# Altium schematic sheet 5V0_Buck.SchDoc: Edit Title in Document Parameters
size B; Address1: # and Street; Address2: City, State, Zip; Address3: Phone#; Address4: USA; DocumentNumber: 2; SheetNumber: 2; SheetTotal: 4; CompanyName: CompanyName; TemplateRev: D-PCD-0111-01
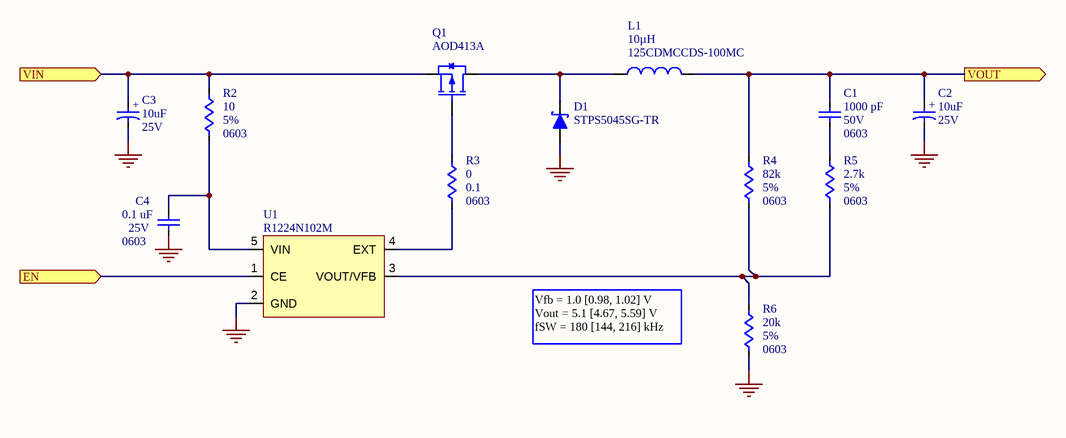
[diagram p0: 5V0_Buck.SchDoc]

## Parts
C1  value 1000 pF  Voltage-Rated: 50V  Package / Case: 0603  [CAPC1608X09N]  (hidden comment: CAP)
C2  value 10uF  Voltage-Rated: 25V  [CAP_TH_5X12_L5]  (hidden comment: CAP-POL)
C3  value 10uF  Voltage-Rated: 25V  [CAP_TH_5X12_L5]  (hidden comment: CAP-POL)
C4  value 0.1 uF  Voltage-Rated: 25V  Package / Case: 0603  [CAPC1608X09N]  (hidden comment: CAP)
D1  Manufacturer Part Number 1: STPS5045SG-TR  [DPAK254P1540X460-3N_STPS5045SG-TR]  (hidden comment: DIO-Schottky_STPS8L30B-TR)
L1  Inductance: 10µH  [125CDMCCDS-100MC]  (hidden comment: INDUCTOR)
Q1  Manufacturer Part Number 1: AOD413A  [DPAK228P991X238-3N_AOD413A]  (hidden comment: PFET_SOT323)
R2  value 10  Tolerance: 5%  Package: 0603  [RESC1508X09N]  (hidden comment: RES)
R3  value 0  Power Rating: 0.1  Package: 0603  [RESC1508X09N]  (hidden comment: RES)
R4  value 82k  Tolerance: 5%  Package: 0603  [RESC1508X09N]  (hidden comment: RES)
R5  value 2.7k  Tolerance: 5%  Package: 0603  [RESC1508X09N]  (hidden comment: RES)
R6  value 20k  Tolerance: 5%  Package: 0603  [RESC1508X09N]  (hidden comment: RES)
U1  R1224N102M  [SOT95P280X120-5N_R1224N102M]

## Ports
EN (in), VIN (in), VOUT (out)

## Nets
GND: C2.2 C3.2 C4.2 D1.A R6.1 U1.2(GND)
EN: U1.1(CE) ; port EN
VIN: C3.1 Q1.S R2.2 ; port VIN
VOUT: C1.1 C2.1 L1.2 R4.2 ; port VOUT
NetC1_2: C1.2 R5.1
NetC4_1: C4.1 R2.1 U1.5(VIN)
NetD1_K: D1.K L1.1 Q1.D
NetQ1_G: Q1.G R3.2
NetR3_1: R3.1 U1.4(EXT)
NetR4_1: R4.1 R5.2 R6.2 U1.3(VOUT/VFB)

Not connected (* = marked no-connect by the designer): D1 NC

## Notes on the sheet
- Vfb = 1.0 [0.98, 1.02] V
  Vout = 5.1 [4.67, 5.59] V
  fSW = 180 [144, 216] kHz
- 4
- 3
- 2
- 1
- D
- C
- B
- 1455 Market St., Ste 600
- A
- San Francisco, CA 94103
- WWW.SQUAREUP.COM
- SIZE
- TITLE
- PRINT DATE
- DRAWING NO.
- REVISION
- RELEASE/EDITION
- © SQUARE INC
- PROPRIETARY AND CONFIDENTIAL.
- ALL RIGHTS RESERVED. NO DUPLICATION, USE OR
- DISCLOSURES WITHOUT PRIOR WRITTEN APPROVAL.
- JIRA EPIC
- SHEET            OF
- (in symbol CAP-TH-0001) +
- (in symbol CAP-TH-0004) +

## Library data of the parts
C1 = CAP-SMT-0004: CAP CER 1000PF 50V X7R 0603; Manufacturer 1: Samsung Electro-Mechanics; Manufacturer Part Number 1: CL10B102KB8NNNC; Tolerance: 10%; TPN: CAP-SMT-0004; Temperature Coefficient: X7R; Operating Temperature: -55°C ~ 125°C; Size / Dimension: 0.063" L x 0.031" W (1.60mm x 0.80mm); Supplier 1: Digi-Key; Supplier Part Number 1: 1276-1018-1-ND; Supplier Link 1: https://www.digikey.com/en/products/detail/samsung-electro-mechanics/CL10B102KB8NNNC/3886676
C2 = CAP-TH-0004: CAP ALUM 47UF 20% 25V RADIAL; Manufacturer 1: KEMET; Manufacturer Part Number 1: ESK476M025AC3FA; Lifetime @ Temp: 2000; Polarization: Polar; Ripple Current @ Low Frequency: 135 mA @ 120 Hz; Ripple Current @ High Frequency: 202.5 mA @ 10 kHz; TPN: CAP-TH-0004; Tolerance: 20%; ESR: -; Operating Temperature: -40°C ~ 85°C; Lead Spacing: 0.197" (5.00mm); Size / Dimension: 0.197" Dia (5.00mm)); Height - Seated (Max): 0.492"(12.5mm); Mounting Type: Through Hole; Package / Case: Radial, Can; Supplier 1: Digi-Key; Supplier Part Number 1: 399-ESK476M025AC3FACT-ND; Supplier Link 1: https://www.digikey.com/en/products/detail/kemet/ESK476M025AC3FA/13979958
C3 = CAP-TH-0001: CAP ALUM 10UF 20% 25V RADIAL; Manufacturer 1: Panasonic Electronic Components; Manufacturer Part Number 1: ECA-1EM100B; Lifetime @ Temp: 2000; Polarization: Polar; Ripple Current @ Low Frequency: 50mA @ 120Hz; Ripple Current @ High Frequency: 85mA @ 10kHz; TPN: CAP-TH-0001; Tolerance: 20%; ESR: -; Operating Temperature: -40°C ~ 85°C; Lead Spacing: 0.197" (5.00mm); Size / Dimension: 0.197" Dia (5.00mm)); Height - Seated (Max): 0.472" (12.00mm); Mounting Type: Through Hole; Package / Case: Radial, Can; Supplier 1: Digi-Key; Supplier Part Number 1: P19522CT-ND; Supplier Link 1: https://www.digikey.com/product-detail/en/panasonic-electronic-components/ECA-1EM100B/P19522CT-ND/6109420
C4 = CAP-SMT-0001: CAP CER 0.1UF 25V X5R 0603; Manufacturer 1: Samsung Electro-Mechanics; Manufacturer Part Number 1: CL10A104KA8NNNC; Tolerance: 20%; TPN: CAP-SMT-0001; Temperature Coefficient: X5R; Operating Temperature: -55°C ~ 85°C; Size / Dimension: 0.063" L x 0.031" W (1.60mm x 0.80mm); Supplier 1: Digi-Key; Supplier Part Number 1: 1276-1857-1-ND; Supplier Link 1: http://www.samsungsem.com/kr/support/product-search/mlcc/CL10A104KA8NNNC.jsp; Manufacturer 2: Taiyo Yuden; Manufacturer Part Number 2: EMK107BJ104KAHT; Supplier 2: Digi-Key; Supplier Part Number 2: 587-3308-1-ND
D1 = DIO-GEN-0003: DIODE SCHOTTKY 45V 50A D2PAK; Manufacturer 1: STMicroelectronics; Voltage - Forward (Vf) (Max) @ If: 610mV @ 50A; Speed: Fast Recovery =< 500ns, > 200mA (Io); Current - Reverse Leakage @ Vr: 360µA @ 45V; TPN: DIO-GEN-0003; Voltage - DC Reverse (Vr) (Max): 45V; Current - Average Rectified (Io): 50A; Mounting Type: Surface Mount; Package / Case: TO-263-3, D²Pak (2 Leads + Tab), TO-263AB; Supplier Device Packaging: D²PAK; Operating Temperature - Junction: 200°C (Max); Supplier 1: Digi-Key; Supplier Part Number 1: 497-13279-1-ND; Supplier 1 Link: https://www.digikey.com/en/products/detail/stmicroelectronics/STPS5045SG-TR/3661704
L1 = IND-0001: FIXED IND 10UH 9A 22 MOHM SMD; Manufacturer 1: Sumida America Components Inc.; Tolerance: ±20%; Current - Saturation (Isat): 14A; Shielding: Shielded; DC Resistance (DCR): 22mΩ Max; Inductance Frequency - Test: 100 kHz; TPN: IND-0001; Current Rating (Amps): 9A; Operating Temperature: -55°C ~ 125°C; Mounting Type: Surface Mount; Package / Case: Nonstandard; Supplier Device Package: SMD; Size / Dimension: 0.530" L x 0.496" W (13.45mm x 12.60mm); Height - Seated (Max): 0.197" (5.00MM); Manufacturer Part Number 1: 125CDMCCDS-100MC; Supplier 1: Digi-Key; Supplier Part Number 1: 308-2561-1-ND
Q1 = PMOS-0001: MOSFET P-CH 40V 12A TO252; Manufacturer 1: Alpha & Omega Semiconductor Inc.; Type: P-Channel; Current - Continuous Drain (Id): 12A (Tc); Gate Charge (Qg) (Max) @ Vgs: 21nC @ 10V; Vgs (Max): ±20V; Rds On (Max) @ Id, Vgs: 44mOhm @ 12A, 10V; Vgs(th) (Max) @ Id: 3V @ 250µA; Drive Voltage (Max Rds On, Min Rds On): 4.5V, 10V; TPN: PMOS-0001; Supplier 1: Digi-Key; Supplier Part Number 1: 785-1218-1-ND; Drain to Source Voltage (Vdss): 40V; Operating Temperature: -55°C ~ 175°C (TJ); Package / Case: TO-252-3, DPak (2 Leads + Tab), SC-63; ComponentLink1URL: http://aosmd.com/res/data_sheets/AOD413A.pdf; ComponentLink1Description: Datasheet; ComponentLink2URL: https://www.digikey.com/en/products/detail/alpha-omega-semiconductor-inc/AOD413A/2353883; ComponentLink2Description: Supplier Link
R2 = RES-SM-0194: RES 10 OHM 5% 0603; Power Rating: 0.125; Pulse-Rated: No; TPN: RES-SM-0194
R3 = RES-SM-0677: RES 0 OHM JUMPER 1/10W 0603; Manufacturer 1: Stackpole Electronics Inc; Manufacturer Part Number 1: RMCF0603ZT0R00; Pulse-Rated: No; TPN: RES-SM-0677; Supplier 1: Digi-Key; Supplier Part Number 1: RMCF0603ZT0R00TR-ND; Supplier Link 1: https://www.seielect.com/Catalog/SEI-RMCF_RMCP.pdf; Manufacturer 2: Yageo; Manufacturer Part Number 2: RC0603JR-070RL; Supplier 2: Digi-Key; Supplier Part Number 2: 311-0.0GRTR-ND
R4 = RES-SM-0288: RES 82K OHM 5% 0603; Power Rating: 0.125; Pulse-Rated: No; TPN: RES-SM-0288
R5 = RES-SM-0252: RES 2.7K OHM 5% 0603; Power Rating: 0.125; Pulse-Rated: No; TPN: RES-SM-0252
R6 = RES-SM-0273: RES 20K OHM 5% 0603; Power Rating: 0.125; Pulse-Rated: No; TPN: RES-SM-0273
U1 = ICS-DSC-0002: PWM/VFM STEP-DOWN DCDC CONTROLLE; Manufacturer 1: Nisshinbo Micro Devices Inc.; Manufacturer Part Number 1: R1224N102M-TR-FE; Output Type: Transistor Driver; Output Configuration: Postive; Topology: Buck; Number of Outputs: 1; Voltage - Supply: 2.3v ~ 18.5v; Frequency -  Switching: 180KhZ; Synchronous Rectifier: No; Control Features: Enable; TPN: ICS-DSC-0002; Function: Step-Down; Output Phases: 1; Duty Cycle (Max): 1; Clock Sync: No; Serial Interfaces: -; Operating Temperature: -40°C ~ 85°C; Mounting Type: Surface Mount; Package / Case: SC-74A, SOT-753; Supplier Device Package: SOT-23-5; Supplier 1: Digi-Key; Supplier Part Number 1: 2129-R1224N102M-TR-FECT-ND; Supplier Link 1: https://www.digikey.com/en/products/detail/nisshinbo-micro-devices-inc/R1224N102M-TR-FE/10244897?utm_medium=buyNow&utm_source=FindChips